# Altium schematic sheet [10] - LEDS, BUTTONS.SchDoc: LEDS, BUTTONS
size A4; Organization: Bjørn T. Brodtkorb; Address1: Frode Rinnans veg 161; Address2: 7050 Trondheim; DocumentNumber: 11; Revision: 1.0; SheetNumber: 11; SheetTotal: 13
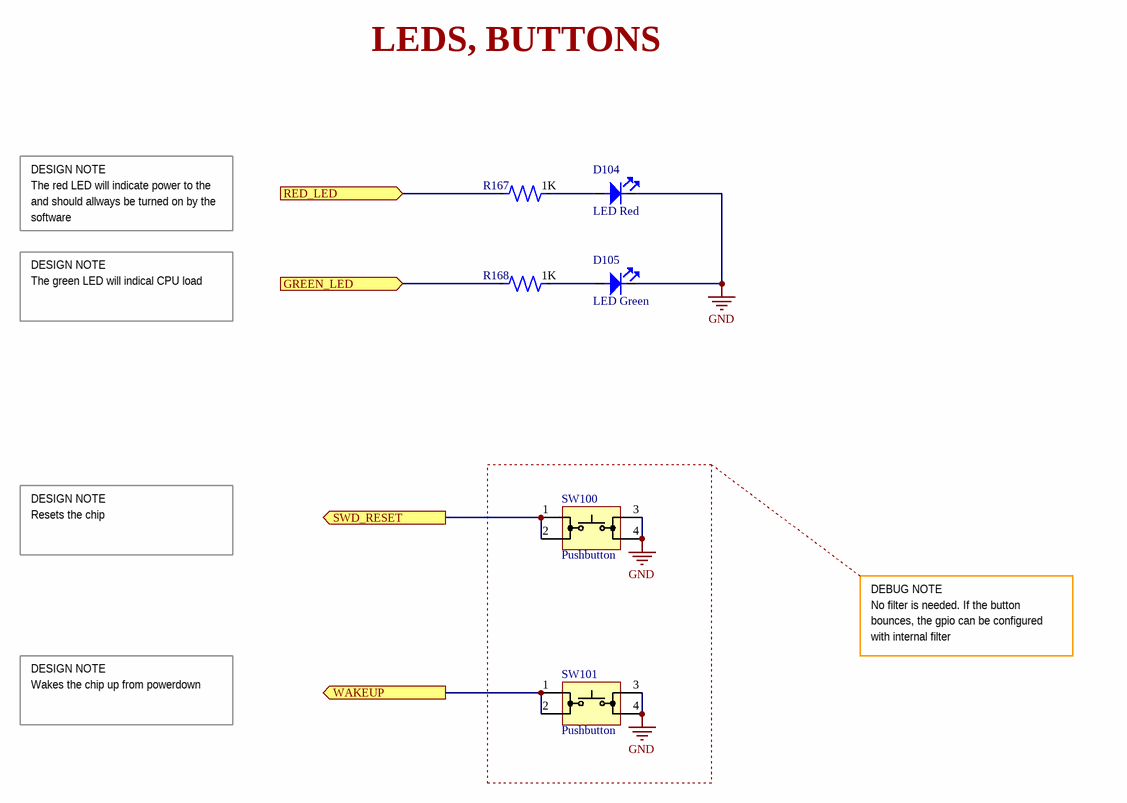
[diagram p0: [10] - LEDS, BUTTONS.SchDoc]

## Parts
D104  LED Red  [L0603 RED]
D105  LED Green  [L0603 GREEN]
R167  value 1K  [R0402]  (hidden comment: CRCW04020000Z0ED)
R168  value 1K  [R0402]  (hidden comment: CRCW04020000Z0ED)
SW100  Pushbutton  [KSC222G LFS]
SW101  Pushbutton  [KSC222G LFS]

## Ports
GREEN_LED (in), RED_LED (in), SWD_RESET (out), WAKEUP (out)

## Nets
GND: D104.2 D105.2 SW100.3 SW100.4 SW101.3 SW101.4
GREEN_LED: R168.1 ; port GREEN_LED
RED_LED: R167.1 ; port RED_LED
SWD_RESET: SW100.1 SW100.2 ; port SWD_RESET
WAKEUP: SW101.1 SW101.2 ; port WAKEUP
NetD104_1: D104.1 R167.2
NetD105_1: D105.1 R168.2

## Notes on the sheet
- LEDS, BUTTONS
- DESIGN NOTE
- The red LED will indicate power to the
- and should allways be turned on by the
- software
- The green LED will indical CPU load
- Resets the chip
- DEBUG NOTE
- No filter is needed. If the button
- bounces, the gpio can be configured
- Wakes the chip up from powerdown
- with internal filter
- Title
- Size:
- Date:
- A4
- Number:
- Time:
- Revision:
- Sheet
- of
- StrawberryHacker
- File:

## Library data of the parts
D104 = HSMG-C190: LED 0603 Red
D105 = HSMG-C196: LED 0603 Green
R167 R168 = CRCW04020000Z0ED: R0402
SW100 SW101 = KSC222G LFS: Pushbutton SMD; Supplier Part Number 1: 2845714; Supplier 1: Farnell